# Altium project SourceFollower_FET_SOT23.PrjPcb
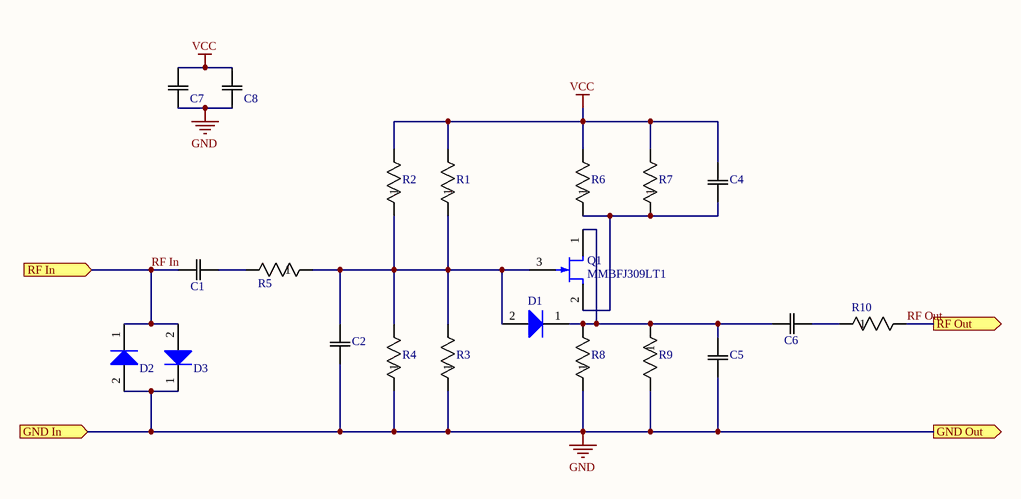
[diagram p0: SourceFollower_FET_SOT23.SchDoc]
1 sheet, 21 parts. Net scope: flat (ports and power ports of the same name join across sheets).
Board file: SourceFollower_FET_SOT23.PcbDoc

## Sheet SourceFollower_FET_SOT23.SchDoc
size A

### Parts
C1  Part Number: C0201C270J3GACTU  [C0201]  (value not drawn)
C2  Part Number: C0201C270J3GACTU  [C0201]  (value not drawn)
C4  Part Number: C0201C270J3GACTU  [C0201]  (value not drawn)
C5  Part Number: C0201C270J3GACTU  [C0201]  (value not drawn)
C6  Part Number: C0201C270J3GACTU  [C0201]  (value not drawn)
C7  Part Number: C0201C270J3GACTU  [C0201]  (value not drawn)
C8  Part Number: C0201C270J3GACTU  [C0201]  (value not drawn)
D1  BAT15-03W  [INF-SOD323_V]  (value not drawn)
D2  BAT15-03W  [INF-SOD323_V]  (value not drawn)
D3  BAT15-03W  [INF-SOD323_V]  (value not drawn)
Q1  MMBFJ309LT1  [ONSC-SOT-23-3-318-08_V]
R1  Part Number: RC0201FR-0718KL  [RES_RC0201_P6XP3]  (value not drawn)
R2  Part Number: RC0201FR-0718KL  [RES_RC0201_P6XP3]  (value not drawn)
R3  Part Number: RC0201FR-0718KL  [RES_RC0201_P6XP3]  (value not drawn)
R4  Part Number: RC0201FR-0718KL  [RES_RC0201_P6XP3]  (value not drawn)
R5  Part Number: RC0201FR-0718KL  [RES_RC0201_P6XP3]  (value not drawn)
R6  Part Number: RC0201FR-0718KL  [RES_RC0201_P6XP3]  (value not drawn)
R7  Part Number: RC0201FR-0718KL  [RES_RC0201_P6XP3]  (value not drawn)
R8  Part Number: RC0201FR-0718KL  [RES_RC0201_P6XP3]  (value not drawn)
R9  Part Number: RC0201FR-0718KL  [RES_RC0201_P6XP3]  (value not drawn)
R10  Part Number: RC0201FR-0718KL  [RES_RC0201_P6XP3]  (value not drawn)

### Ports
GND In (in), GND Out (out), RF In (in), RF Out (out)

### Nets
GND: C2.1 C5.1 C7.1 C8.1 D2.2(A) D3.1(K) R3.1 R4.1 R8.1 R9.2 ; port GND In, port GND Out
VCC: C4.2 C7.2 C8.2 R1.2 R2.2 R6.2 R7.2
RF In: C1.1 D2.1(K) D3.2(A) ; port RF In
RF Out: R10.2 ; port RF Out
NetC1_2: C1.2 R5.2
NetC2_2: C2.2 D1.2(A) Q1.3(G) R1.1 R2.1 R3.2 R4.2 R5.1
NetC4_1: C4.1 Q1.2(S) R6.1 R7.1
NetC5_2: C5.2 C6.2 D1.1(K) Q1.1(D) R8.2 R9.1
NetC6_1: C6.1 R10.1

### Library data of the parts
C1 C2 C4-C8 = C0201C270J3GACTU: No Description Available; Vendor: Kemet; Built_By: EMA_UL_Team; Type: DEV; Manufacturer_Part_Number: C0201C270J3GACTU; Copyright: Copyright (C) 2018 Accelerated Designs. All rights reserved; RefDes: RefDes; Value: Value
D1-D3 = BAT15-03W: Single Silicon Schottky Diode, 110 mA IF Max, SOD32, Green; Manufacturer: Infineon; CT (typ): 0.26 pF; Green: yes; Group: RF Mixer; IF (max): 110 mA; VF (typ): 0.23 V; VR (max): 4 V; DatasheetVersion: Jun-2011; PackageReference: SOD323; PackageDescription: 2-Pin Small Outline Diode Package, 1.25 x 1.7 mm Body; Supplier 1: Mouser; Supplier Part Number 1: N/A; Configuration: Single; Mounting Technology: Surface Mount; PartNumber: BAT15-03W; ComponentLink1Description: Manufacturer URL; ComponentLink1URL: http://www.infineon.com/; ComponentLink2Description: Datasheet; ComponentLink2URL: http://www.infineon.com/dgdl/bat15series.pdf?folderId=db3a304314dca3890114ff6812070b44&fileId=db3a304314dca3890114ff6b74ca0b48&location=en.Products.RF.RF_Mixer___Detector_Schottky_Diodes.DATASHEET.bat15series.pdf; ComponentLink3Description: Package Specification; ComponentLink3URL: http://www.infineon.com/dgdl/SOD323-Package_Overview.pdf?folderId=db3a30431936bc4b011952aab84f3bbe&fileId=db3a30431936bc4b011952beed653be3
Q1 = MMBFJ309LT1: JFET - VHF / UHF Amplifier Transistor, N-Channel, 3-Pin SOT-23, Tape and Reel; Manufacturer: On Semiconductor; Channel Polarity: N Channel; Ciss Max (pF): 5; Crss Max (pF): 2.5; IDSS Max (uA): 30000; IDSS Min (uA): 12000; V(BR)GSS Min (V): 25; DatasheetVersion: Rev. 7; PackageVersion: Rev. AP, 11/2009; PackageReference: SOT-23-3-318-08; PackageDescription: 3-Pin Small Outline Transistor, Body 2.92 x 1.3 mm, Pitch 0.95 mm; Supplier 1: Digi-Key; Supplier Part Number 1: MMBFJ309LT1OSCT-ND; Packing: Tape and Reel; Mounting Technology: Surface Mount; PartNumber: MMBFJ309LT1; ComponentLink1Description: Manufacturer URL; ComponentLink1URL: http://www.onsemi.com/; ComponentLink2Description: Datasheet; ComponentLink2URL: http://www.onsemi.cn/pub_link/Collateral/MMBFJ309LT1-D.PDF; ComponentLink3Description: Package Specification; ComponentLink3URL: http://www.onsemi.cn/pub_link/Collateral/318-08.PDF
R1-R10 = RC0201FR-0718KL: No Description Available; Vendor: Yageo; Built_By: EMA_Anthony; Copyright: Copyright (C) 2018 Accelerated Designs. All rights reserved; Manufacturer_Part_Number: RC0201FR-0718KL; RefDes: RefDes; Type: DEV; Value: Value